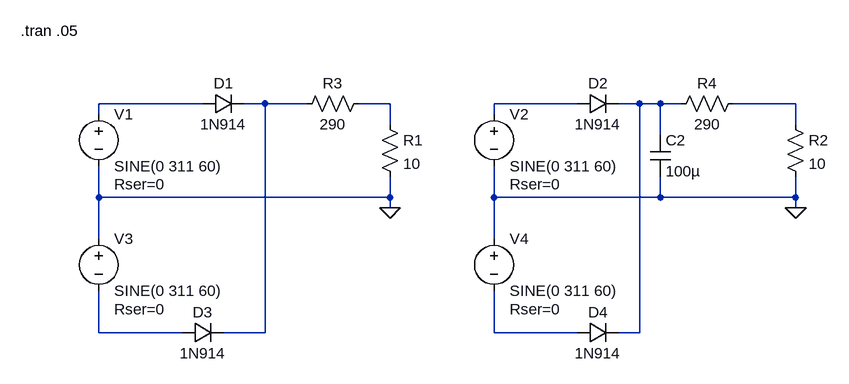
[diagram p0: schematic Diodo - RetificadorOndaCompleta_MeiaPonte.asc]
Diodo - RetificadorOndaCompleta_MeiaPonte.asc, the LTspice schematic file:
Version 4
SHEET 1 980 680
WIRE 0 160 -160 160
WIRE 96 160 64 160
WIRE 160 160 96 160
WIRE 288 160 240 160
WIRE 576 160 448 160
WIRE 672 160 640 160
WIRE 704 160 672 160
WIRE 736 160 704 160
WIRE 912 160 816 160
WIRE -160 176 -160 160
WIRE 448 176 448 160
WIRE 288 192 288 160
WIRE 912 192 912 160
WIRE 704 208 704 160
WIRE -160 304 -160 256
WIRE 288 304 288 272
WIRE 288 304 -160 304
WIRE 448 304 448 256
WIRE 704 304 704 272
WIRE 704 304 448 304
WIRE 912 304 912 272
WIRE 912 304 704 304
WIRE 288 320 288 304
WIRE 912 320 912 304
WIRE -160 368 -160 304
WIRE 448 368 448 304
WIRE -160 512 -160 448
WIRE -32 512 -160 512
WIRE 96 512 96 160
WIRE 96 512 32 512
WIRE 448 512 448 448
WIRE 576 512 448 512
WIRE 672 512 672 160
WIRE 672 512 640 512
FLAG 288 320 0
FLAG 912 320 0
SYMBOL res 272 176 R0
SYMATTR InstName R1
SYMATTR Value 10
SYMBOL diode 0 176 R270
WINDOW 0 32 32 VTop 2
WINDOW 3 0 32 VBottom 2
SYMATTR InstName D1
SYMATTR Value 1N914
SYMBOL voltage -160 160 R0
WINDOW 123 0 0 Left 2
WINDOW 39 24 124 Left 2
SYMATTR SpiceLine Rser=0
SYMATTR InstName V1
SYMATTR Value SINE(0 311 60)
SYMBOL res 896 176 R0
SYMATTR InstName R2
SYMATTR Value 10
SYMBOL diode 576 176 R270
WINDOW 0 32 32 VTop 2
WINDOW 3 0 32 VBottom 2
SYMATTR InstName D2
SYMATTR Value 1N914
SYMBOL voltage 448 160 R0
WINDOW 123 0 0 Left 2
WINDOW 39 24 124 Left 2
SYMATTR SpiceLine Rser=0
SYMATTR InstName V2
SYMATTR Value SINE(0 311 60)
SYMBOL voltage -160 352 R0
WINDOW 123 0 0 Left 2
WINDOW 39 24 124 Left 2
SYMATTR SpiceLine Rser=0
SYMATTR InstName V3
SYMATTR Value SINE(0 311 60)
SYMBOL diode -32 528 R270
WINDOW 0 32 32 VTop 2
WINDOW 3 0 32 VBottom 2
SYMATTR InstName D3
SYMATTR Value 1N914
SYMBOL voltage 448 352 R0
WINDOW 123 0 0 Left 2
WINDOW 39 24 124 Left 2
SYMATTR SpiceLine Rser=0
SYMATTR InstName V4
SYMATTR Value SINE(0 311 60)
SYMBOL diode 576 528 R270
WINDOW 0 32 32 VTop 2
WINDOW 3 0 32 VBottom 2
SYMATTR InstName D4
SYMATTR Value 1N914
SYMBOL res 144 176 R270
WINDOW 0 32 56 VTop 2
WINDOW 3 0 56 VBottom 2
SYMATTR InstName R3
SYMATTR Value 290
SYMBOL res 720 176 R270
WINDOW 0 32 56 VTop 2
WINDOW 3 0 56 VBottom 2
SYMATTR InstName R4
SYMATTR Value 290
SYMBOL cap 688 208 R0
SYMATTR InstName C2
SYMATTR Value 100µ
TEXT -280 48 Left 2 !.tran .05

The netlist it stands for:
* Diodo - RetificadorOndaCompleta_MeiaPonte.asc
R1 N003 0 10
D1 N001 N002 1N914
V1 N001 0 SINE(0 311 60) Rser=0
R2 N006 0 10
D2 N004 N005 1N914
V2 N004 0 SINE(0 311 60) Rser=0
V3 0 N007 SINE(0 311 60) Rser=0
D3 N007 N002 1N914
V4 0 N008 SINE(0 311 60) Rser=0
D4 N008 N005 1N914
R3 N002 N003 290
R4 N005 N006 290
C2 N005 0 100µ
.model D D
.lib standard.dio
.tran .05
.backanno
.end